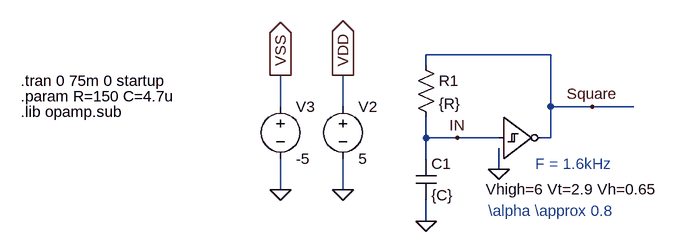
[diagram p0: schematic SchmittTrigger.asc]
SchmittTrigger.asc, the LTspice schematic file:
Version 4
SHEET 1 880 680
WIRE -112 -544 -304 -544
WIRE -304 -528 -304 -544
WIRE -528 -464 -528 -512
WIRE -432 -464 -432 -512
WIRE -112 -464 -112 -544
WIRE -48 -464 -112 -464
WIRE 16 -464 -48 -464
WIRE -304 -416 -304 -448
WIRE -256 -416 -304 -416
WIRE -192 -416 -256 -416
WIRE -112 -416 -112 -464
WIRE -112 -416 -128 -416
WIRE -304 -384 -304 -416
WIRE -192 -368 -192 -400
WIRE -528 -336 -528 -384
WIRE -432 -336 -432 -384
WIRE -304 -288 -304 -320
FLAG -192 -368 0
FLAG -304 -288 0
FLAG -256 -416 IN
FLAG -432 -336 0
FLAG -432 -512 VDD
IOPIN -432 -512 Out
FLAG -528 -336 0
FLAG -528 -512 VSS
IOPIN -528 -512 Out
FLAG -48 -464 Square
SYMBOL res -320 -544 R0
SYMATTR InstName R1
SYMATTR Value {R}
SYMBOL cap -320 -384 R0
SYMATTR InstName C1
SYMATTR Value {C}
SYMBOL Digital\\schmtinv -192 -480 R0
WINDOW 0 8 32 Invisible 2
WINDOW 123 -20 143 Left 2
SYMATTR InstName A2
SYMATTR Value2 Vhigh=6 Vt=2.9 Vh=0.65
SYMATTR SpiceLine Td=12n
SYMBOL voltage -432 -480 R0
SYMATTR InstName V2
SYMATTR Value 5
SYMBOL voltage -528 -480 R0
SYMATTR InstName V3
SYMATTR Value -5
TEXT -928 -456 Left 2 !.lib opamp.sub
TEXT -928 -504 Left 2 !.tran 0 75m 0 startup
TEXT -928 -480 Left 2 !.param R=150 C=4.7u
TEXT -136 -376 Left 2 ;F = 1.6kHz
TEXT -208 -304 Left 2 ;\\alpha \\approx 0.8

The netlist it stands for:
* SchmittTrigger.asc
R1 Square IN {R}
C1 IN 0 {C}
A2 IN 0 0 0 0 Square 0 0 SCHMITT Vhigh=6 Vt=2.9 Vh=0.65 Td=12n
V2 VDD 0 5
V3 VSS 0 -5
.lib opamp.sub
.tran 0 75m 0 startup
.param R=150 C=4.7u
* F = 1.6kHz
* \alpha \approx 0.8
.backanno
.end